# Altium schematic sheet MainBoard.SchDoc: Main IC
size A4; DrawnBy: Nino Bleus; DocumentNumber: 1EAI2020001; Revision: V1.0.0; SheetNumber: 4; SheetTotal: 4; Application_BuildNumber: 1EAI2020001
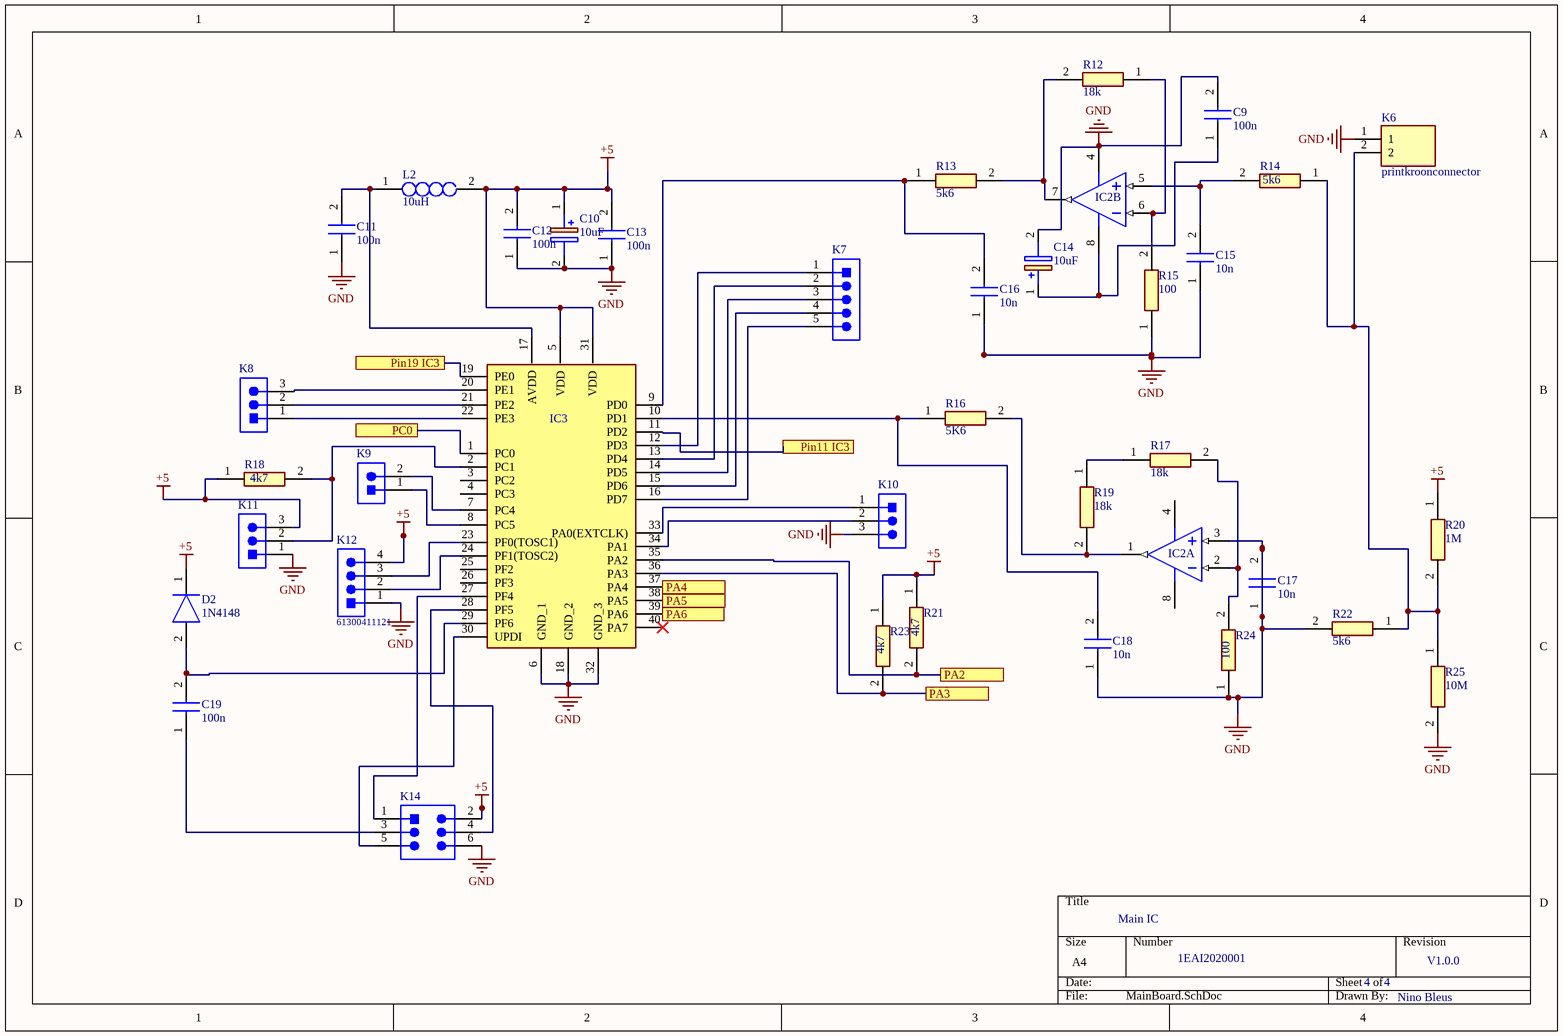
[diagram p0: MainBoard.SchDoc]

## Parts
C9  100n  [CAPC2012X88N]
C10  10uF  [CAPPRD250W45D630H850]
C11  100n  [CAPC2012X88N]
C12  100n  [CAPC2012X88N]
C13  100n  [CAPC2012X88N]
C14  10uF  [CAPPRD250W45D630H850]
C15  10n  [CAPC2012X88N]
C16  10n  [CAPC2012X88N]
C17  10n  [CAPC2012X88N]
C18  10n  [CAPC2012X88N]
C19  100n  [CAPC2012X88N]
D2  1N4148  [DIOAD1165W56L425D185]
IC2  MCP6002-E/P  [PDIP300-P8]  (value not drawn)  (parts A,B of 2)
IC3  ATMEGA4809-PF  [DIP1543W58P254L5175H635Q40N]  (value not drawn)
K6  printkroonconnector  [1729128]
K7  61300511121  [61300511121]  (value not drawn)
K8  61300311121  [61300311121]  (value not drawn)
K9  61300211121  [61300211121]  (value not drawn)
K10  61300311121  [61300311121]  (value not drawn)
K11  61300311121  [61300311121]  (value not drawn)
K12  61300411121  [61300411121]
K14  61300621121  [61300621121]  (value not drawn)
L2  10uH  [INDAD1827W51L711D279]
R12  18k  [RESC2012X65N]
R13  5k6  [RESC2012X65N]
R14  5k6  [RESC2012X65N]
R15  100  [RESC2012X65N]
R16  5K6  [RESC2012X65N]
R17  18k  [RESC2012X65N]
R18  4k7  [RESC2012X65N]
R19  18k  [RESC2012X65N]
R20  1M  [RESC2012X65N]
R21  4k7  [RESC2012X65N]
R22  5k6  [RESC2012X65N]
R23  4k7  [RESC2012X65N]
R24  100  [RESC2012X65N]
R25  10M  [RESC2012X65N]

## Ports
PA2, PA3, PA4, PA5, PA6, PC0, Pin11 IC3, Pin19 IC3

## Nets
+5: C10.1(+) C12.2 C13.2 D2.1(K) IC3.5(VDD) IC3.31(VDD) K11.3 K12.4 K14.2 L2.2 R18.1 R20.1 R21.1 R23.1
GND: C9.2 C10.2(-) C11.1 C12.1 C13.1 C14.2(-) C15.1 C16.1 C17.1 C17.2 C18.1 IC2.3(VINA+) IC2.4(VSS) IC3.6(GND_1) IC3.18(GND_2) IC3.32(GND_3) K6.1 K10.3 K11.1 K12.1 K14.6 R15.1 R22.2 R24.1 R25.2
PA2: IC3.35(PA2) R21.2 ; port PA2
PA3: IC3.36(PA3) R23.2 ; port PA3
PA4: IC3.37(PA4) ; port PA4
PA5: IC3.38(PA5) ; port PA5
PA6: IC3.39(PA6) ; port PA6
PC0: IC3.1(PC0) ; port PC0
Pin11 IC3: IC3.11(PD2) ; port Pin11 IC3
Pin19 IC3: IC3.19(PE0) ; port Pin19 IC3
NetC9_1: C9.1 C14.1(+) IC2.8(VDD)
NetC11_2: C11.2 IC3.17(AVDD) L2.1
NetC15_2: C15.2 IC2.5(VINB+) R14.2
NetC16_2: C16.2 IC3.9(PD0) R13.1
NetC18_2: C18.2 IC3.10(PD1) R16.1
NetC19_1: C19.1 K14.3
NetC19_2: C19.2 D2.2(A) IC3.29(PF6)
NetIC2_1: IC2.1(VOUTA) R16.2 R19.2
NetIC2_2: IC2.2(VINA-) R17.2 R24.2
NetIC2_6: IC2.6(VINB-) R12.1 R15.2
NetIC2_7: IC2.7(VOUTB) R12.2 R13.2
NetIC3_2: IC3.2(PC1) K11.2 R18.2
NetIC3_7: IC3.7(PC4) K9.2
NetIC3_8: IC3.8(PC5) K9.1
NetIC3_12: IC3.12(PD3) K7.1
NetIC3_13: IC3.13(PD4) K7.2
NetIC3_14: IC3.14(PD5) K7.3
NetIC3_15: IC3.15(PD6) K7.4
NetIC3_16: IC3.16(PD7) K7.5
NetIC3_20: IC3.20(PE1) K8.3
NetIC3_21: IC3.21(PE2) K8.2
NetIC3_22: IC3.22(PE3) K8.1
NetIC3_23: IC3.23(PF0(TOSC1)) K12.3
NetIC3_24: IC3.24(PF1(TOSC2)) K12.2
NetIC3_27: IC3.27(PF4) K14.1
NetIC3_28: IC3.28(PF5) K14.4
NetIC3_30: IC3.30(UPDI) K14.5
NetIC3_33: IC3.33(PA0(EXTCLK)) K10.1
NetIC3_34: IC3.34(PA1) K10.2
NetK6_2: K6.2 R14.1 R20.2 R22.1 R25.1
NetR17_1: R17.1 R19.1

Not connected (* = marked no-connect by the designer): IC3 3(PC2) 4(PC3) 25(PF2) 26(PF3) 40(PA7)*

## Library data of the parts
C9 C11-C13 C15-C19 = 0805 SMD capaciteit: Capacitor; Manufacturer_Name: Kemet; Manufacturer_Part_Number: C0805C103K5RACTU; Datasheet Link: https://ms.componentsearchengine.com/Datasheets/2/C0805C103K5RACTU.pdf; Height: 0.88mm
C10 C14 = 10uF Capaciteit: Capacitor Polarised; Manufacturer_Name: Kemet; Manufacturer_Part_Number: ESS106M050AE2AA; Datasheet Link: https://content.kemet.com/datasheets/KEM_A4057_ESS.pdf; Height: 8.5mm
D2 = 1N4148: Diode; Manufacturer_Name: Nexperia; Datasheet Link: https://datasheet.datasheetarchive.com/originals/distributors/Datasheets-112/DSAP0040891.pdf; Manufacturer_Part_Number: 1N4148
IC2 = CMP-0187-00133-3: None; Slew Rate: 0.6V/µs; Supply Current: 100uA; Power Supply Rejection Ratio (PSRR): 86dB; Input Offset Voltage (Vos): 4.5mV; Input Bias Current: 1pA; Amplifier Type: GENERAL PURPOSE; Unity Gain Bandwidth Product: 1MHz; Number of Circuits: 2; Output Current: 23mA; Operating Supply Voltage: 5.5V; Min Supply Voltage: 1.8V; Common Mode Rejection Ratio: 60dB; Voltage Gain: 112dB; Max Supply Voltage: 6V; Package Quantity: 60; REACH SVHC: No SVHC; Min Operating Temperature: -40°C; Max Operating Temperature: 125°C; Mount: Through Hole; Nominal Supply Current: 100uA; Height: 3.3mm; Length: 9.27mm; Slew Rate-Nom: 0.6V/µs; Packaging: Rail/Tube; Output Current per Channel: 23mA; Number of Amplifiers: 2; RoHS Compliant: Yes; Radiation Hardening: No; Bandwidth: 1MHz; Lead Free: Lead Free; Width: 6.35mm; Number of Channels: 2; Gain Bandwidth Product: 1MHz; Technology: CMOS; Operating Supply Current: 100uA; Number of Elements: 2; Number of Pins: 8; Input Offset Voltage-Max: 4.5mV; Case/Package: PDIP
IC3 = ATMEGA4809-PF: Integrated Circuit; Manufacturer_Name: Microchip; Datasheet Link: https://componentsearchengine.com//ATMEGA4809-PF.pdf; Height: 6.35mm; Mouser2 Part Number: 556-ATMEGA4809-PF; Mouser2 Price/Stock: https://www.mouser.com/Search/Refine.aspx?Keyword=556-ATMEGA4809-PF; Manufacturer_Part_Number: ATMEGA4809-PF
K6 = printkroonconnector: Connector; Manufacturer_Name: Phoenix Contact; Datasheet Link: http://www.phoenixcontact.com/de/produkte/1729128/pdf; Height: 10.15mm; Manufacturer_Part_Number: 1729128
K7 = 61300511121: WR-PHD Pin Header, THT, pitch 2.54mm, Single Row, Vertical, 5p; Manufacturer: Wurth Elektronik; Pin Number: 5; Rated Current: 3A; Working Voltage: 250VAC; Withstanding Voltage: 500VAC; Contact Resistance: 20mOhm; ComponentLink1Description: Manufacturer; ComponentLink1URL: http://www.we-online.de; ComponentLink2Description: Datasheet; ComponentLink2URL: https://www.we-online.com/catalog/datasheet/61300511121.pdf; Manufacturer Part Number: 61300511121; Pitch: 2.54mm; Operating Temperature: -40 to +105degC; Mounting Technology: THT; Packaging: Bag; Gender: Pin Header; Row Number: Single; Orientation: Vertical
K8 K10 K11 = 61300311121: WR-PHD Pin Header, THT, pitch 2.54mm, Single Row, Vertical, 3p; Manufacturer: Wurth Elektronik; Pin Number: 3; Rated Current: 3A; Working Voltage: 250VAC; Withstanding Voltage: 500VAC; Contact Resistance: 20mOhm; ComponentLink1Description: Manufacturer; ComponentLink1URL: http://www.we-online.de; ComponentLink2Description: Datasheet; ComponentLink2URL: https://www.we-online.com/catalog/datasheet/61300311121.pdf; Manufacturer Part Number: 61300311121; Pitch: 2.54mm; Operating Temperature: -40 to +105degC; Mounting Technology: THT; Packaging: Bag; Gender: Pin Header; Row Number: Single; Orientation: Vertical
K9 = 61300211121: WR-PHD Pin Header, THT, pitch 2.54mm, Single Row, Vertical, 2p; Manufacturer: Wurth Elektronik; Pin Number: 2; Rated Current: 3A; Working Voltage: 250VAC; Withstanding Voltage: 500VAC; Contact Resistance: 20mOhm; ComponentLink1Description: Manufacturer; ComponentLink1URL: http://www.we-online.de; ComponentLink2Description: Datasheet; ComponentLink2URL: https://www.we-online.com/catalog/datasheet/61300211121.pdf; Manufacturer Part Number: 61300211121; Pitch: 2.54mm; Operating Temperature: -40 to +105degC; Mounting Technology: THT; Packaging: Bag; Gender: Pin Header; Row Number: Single; Orientation: Vertical
K12 = 61300411121: WR-PHD Pin Header, THT, pitch 2.54mm, Single Row, Vertical, 4p; Manufacturer: Wurth Elektronik; Pin Number: 4; Rated Current: 3A; Working Voltage: 250VAC; Withstanding Voltage: 500VAC; Contact Resistance: 20mOhm; ComponentLink1Description: Manufacturer; ComponentLink1URL: http://www.we-online.de; ComponentLink2Description: Datasheet; ComponentLink2URL: https://www.we-online.com/catalog/datasheet/61300411121.pdf; Manufacturer Part Number: 61300411121; Pitch: 2.54mm; Operating Temperature: -40 to +105degC; Mounting Technology: THT; Packaging: Bag; Gender: Pin Header; Row Number: Single; Orientation: Vertical
K14 = 61300621121: WR-PHD Pin Header, THT, pitch 2.54mm, Dual Row, Vertical, 6p; Manufacturer: Wurth Elektronik; Pin Number: 6; Rated Current: 3A; Working Voltage: 250VAC; Withstanding Voltage: 500VAC; Contact Resistance: 20mOhm; ComponentLink1Description: Manufacturer; ComponentLink1URL: http://www.we-online.de; ComponentLink2Description: Datasheet; ComponentLink2URL: https://www.we-online.com/catalog/datasheet/61300621121.pdf; Manufacturer Part Number: 61300621121; Pitch: 2.54mm; Operating Temperature: -40 to +105degC; Mounting Technology: THT; Packaging: Bag; Gender: Pin Header; Row Number: Dual; Orientation: Vertical
L2 = 78F100J-RC: Inductor; Manufacturer_Name: Bourns; Datasheet Link: https://componentsearchengine.com//78F100J-RC.pdf; Mouser2 Part Number: 542-78F100-RC; Mouser2 Price/Stock: https://www.mouser.com/Search/Refine.aspx?Keyword=542-78F100-RC; Manufacturer_Part_Number: 78F100J-RC
R12-R25 = ESR10EZPJ183: Resistor; Manufacturer_Name: ROHM Semiconductor; Datasheet Link: https://datasheet.datasheetarchive.com/originals/distributors/Datasheets_SAMA/30ccb516c688c96e56c83a00b77a93f4.pdf; Height: 0.65mm; Manufacturer_Part_Number: ESR10EZPJ183